# EasyEDA schematic OpenTCUSandwich.json
TITLE: Sheet_1; REV: 1.0; Date: 2024-07-19; Sheet: 1/1; Drawn By: tristan.read1508; Company: Your Company
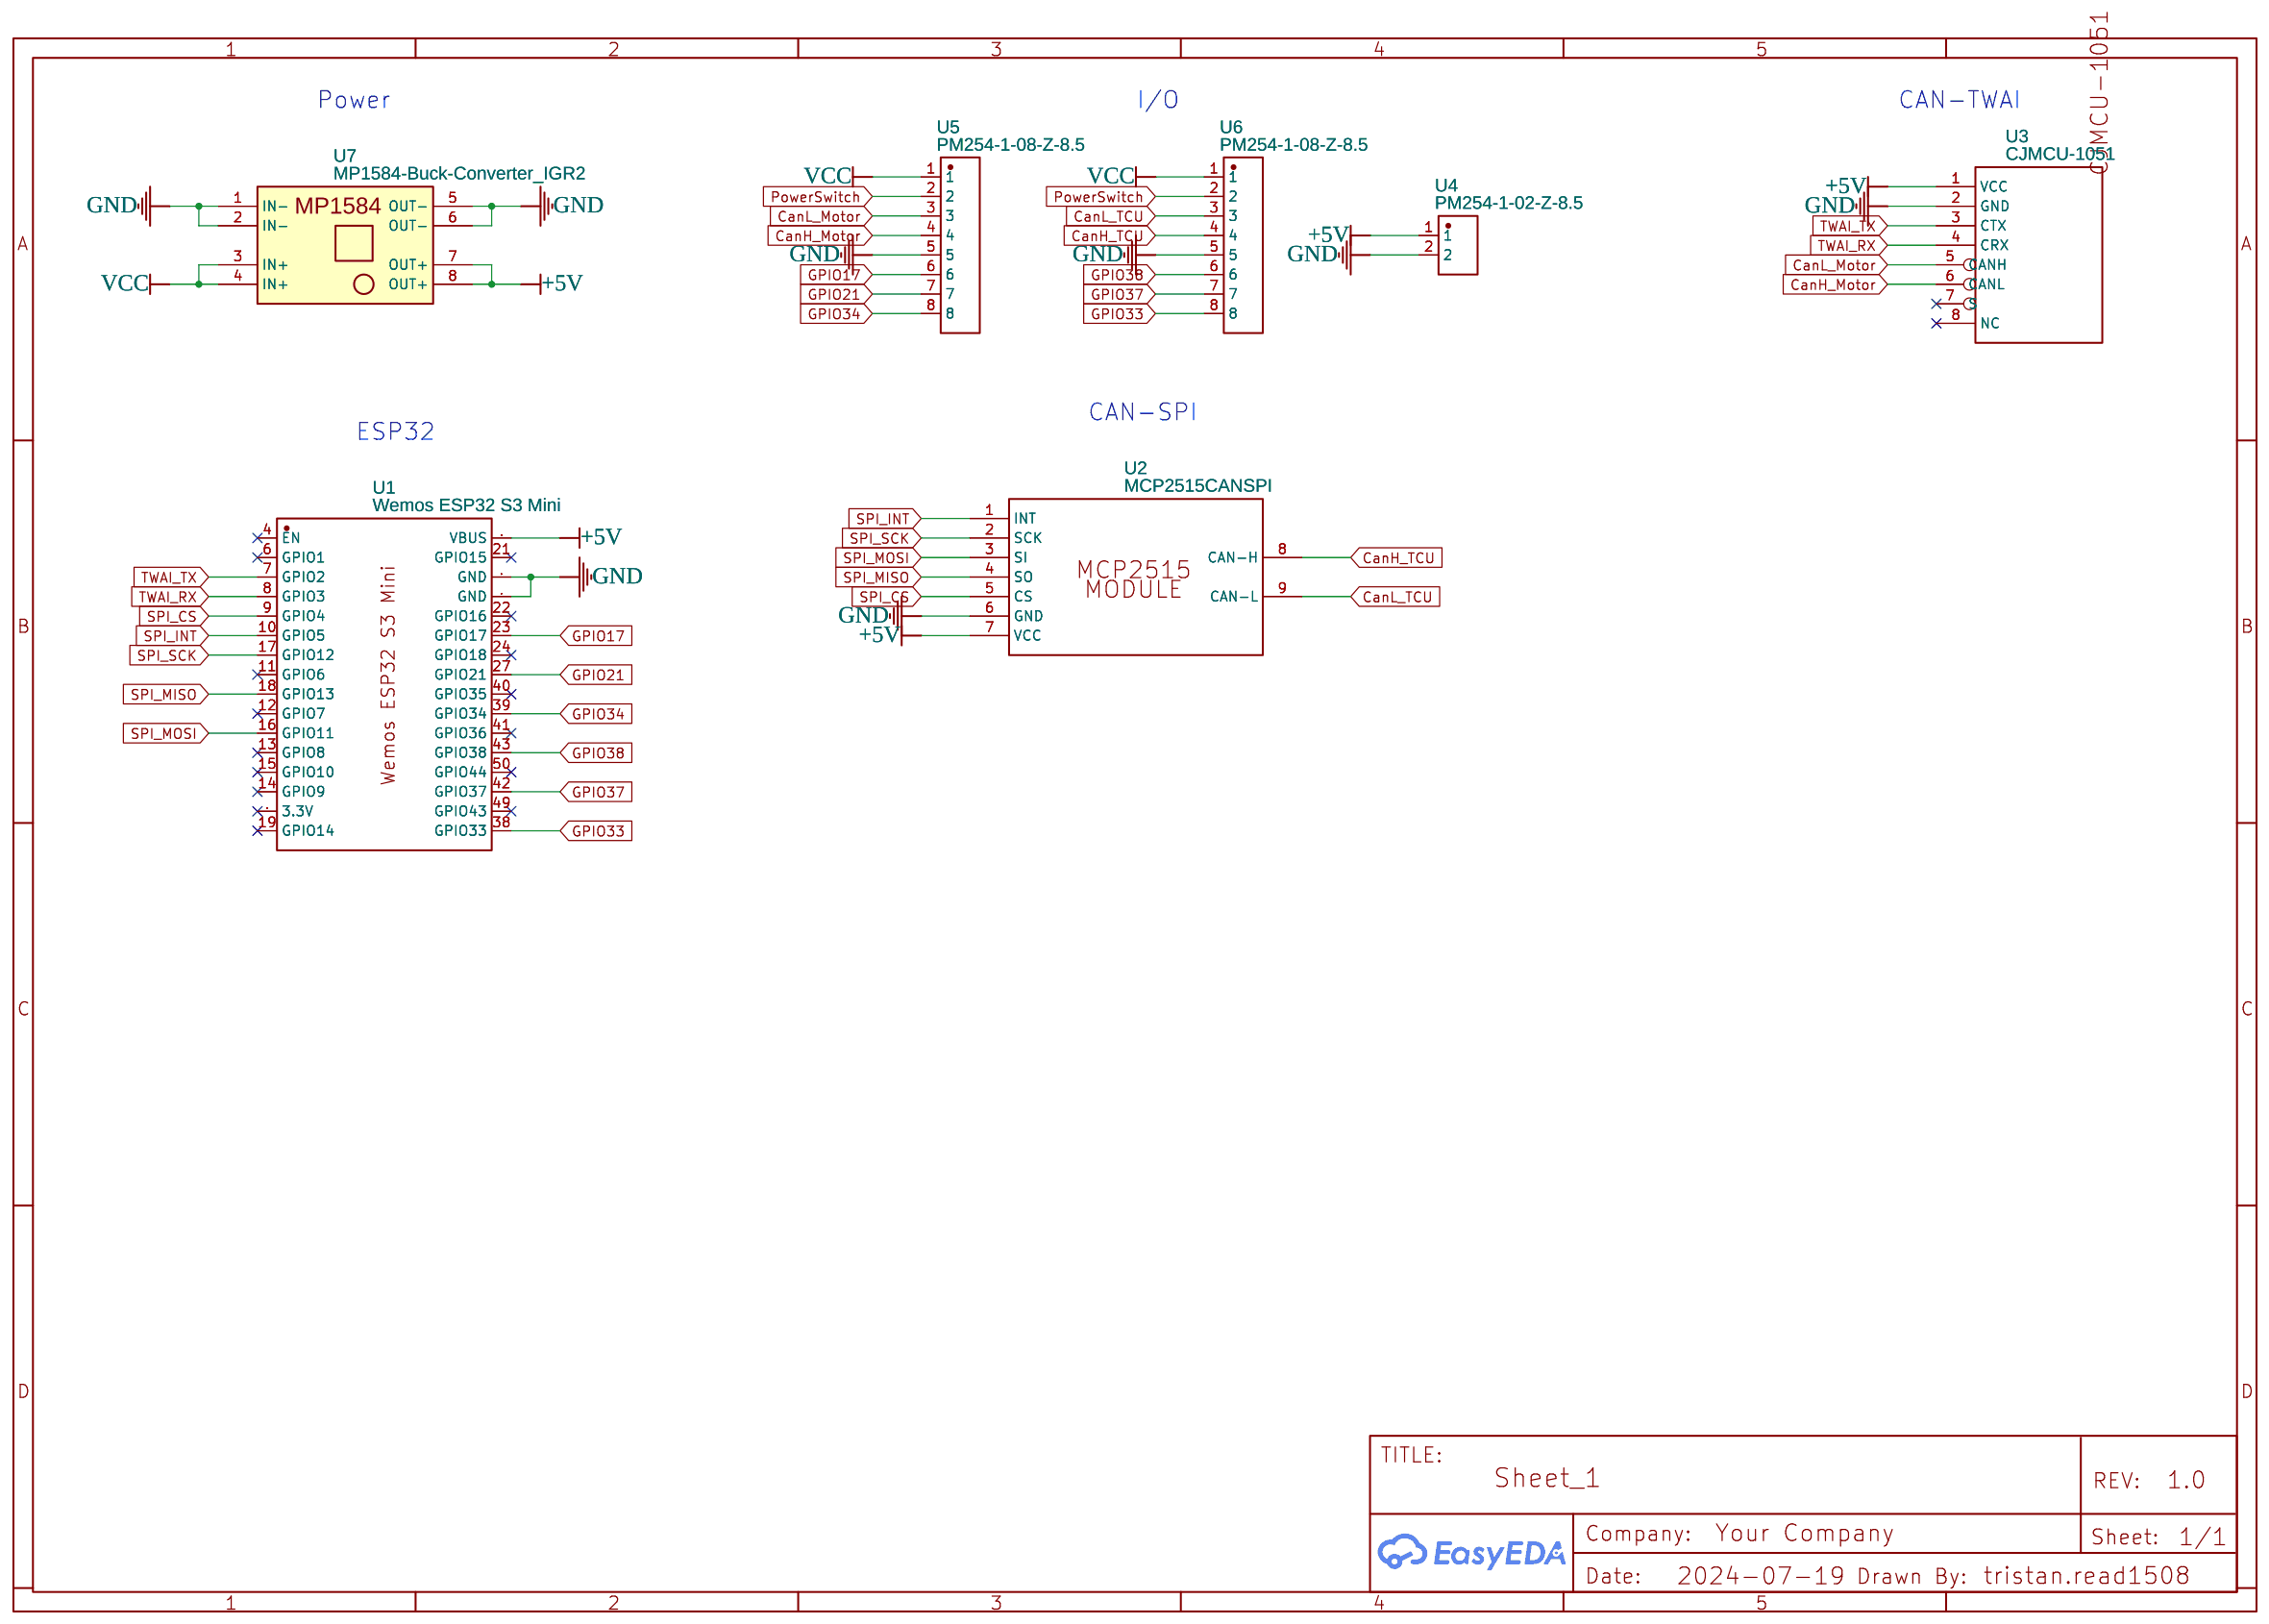
[diagram p0: schematic sheet]

## Parts
U1  Wemos ESP32 S3 Mini  [WEMOS-ESP32-S3-MINI]
U2  MCP2515CANSPI  [MCP2515CANSPI]
U3  CJMCU-1051  [CJMCU-1051]
U4  PM254-1-02-Z-8.5  [HDR-TH_2P-P2.54-V-F]
U5  PM254-1-08-Z-8.5  [HDR-TH_8P-P2.54-V-F]
U6  PM254-1-08-Z-8.5  [HDR-TH_8P-P2.54-V-F]
U7  MP1584-Buck-Converter_IGR2  [MP1584EN-BUCK-CONVERTER]

## Library data of the parts
U1 = Wemos ESP32 S3 Mini: Manufacturer: Wemos; link: https://www.wemos.cc/en/latest/s3/s3_mini.html; Contributor: Guest
U2 = MCP2515CANSPI: Contributor: rclandrover
U3 = CJMCU-1051: Contributor: ratedspg10
U4 = PM254-1-02-Z-8.5: Contributor: LCSC; Supplier: LCSC; Supplier Part: C2897365; Manufacturer: HCTL(华灿天禄); JLCPCB Part Class: Extended Part
U5 U6 = PM254-1-08-Z-8.5: Contributor: LCSC; Supplier: LCSC; Supplier Part: C2897371; Manufacturer: HCTL(华灿天禄); JLCPCB Part Class: Extended Part
U7 = MP1584-Buck-Converter_IGR2: Manufacturer Part: MP1584EN; Contributor: fazli wadood

## Nets
+5V: U1.5(VBUS) U2.7(VCC) U3.1(VCC) U4.1 U7.7(OUT+) U7.8(OUT+)
GND: U1.1(GND) U1.2(GND) U2.6(GND) U3.2(GND) U4.2 U5.5 U6.5 U7.1(IN-) U7.2(IN-) U7.5(OUT-) U7.6(OUT-)
VCC: U5.1 U6.1 U7.3(IN+) U7.4(IN+)
CanH_Motor: U3.6(CANL) U5.4
CanH_TCU: U2.8(CAN-H) U6.4
CanL_Motor: U3.5(CANH) U5.3
CanL_TCU: U2.9(CAN-L) U6.3
GPIO17: U1.23(GPIO17) U5.6
GPIO21: U1.27(GPIO21) U5.7
GPIO33: U1.38(GPIO33) U6.8
GPIO34: U1.39(GPIO34) U5.8
GPIO37: U1.42(GPIO37) U6.7
GPIO38: U1.43(GPIO38) U6.6
PowerSwitch: U5.2 U6.2
SPI_CS: U1.9(GPIO4) U2.5(CS)
SPI_INT: U1.10(GPIO5) U2.1(INT)
SPI_MISO: U1.18(GPIO13) U2.4(SO)
SPI_MOSI: U1.16(GPIO11) U2.3(SI)
SPI_SCK: U1.17(GPIO12) U2.2(SCK)
TWAI_RX: U1.8(GPIO3) U3.4(CRX)
TWAI_TX: U1.7(GPIO2) U3.3(CTX)

Not connected (* = marked no-connect by the designer): U1 3(3.3V)* 4(EN)* 6(GPIO1)* 11(GPIO6)* 12(GPIO7)* 13(GPIO8)* 14(GPIO9)* 15(GPIO10)* 19(GPIO14)* 21(GPIO15)* 22(GPIO16)* 24(GPIO18)* 40(GPIO35)* 41(GPIO36)* 49(GPIO43)* 50(GPIO44)*; U3 7(S)* 8(NC)*

## Notes on the sheet
- Power
- I/O
- CAN-TWAI
- CAN-SPI
- ESP32
